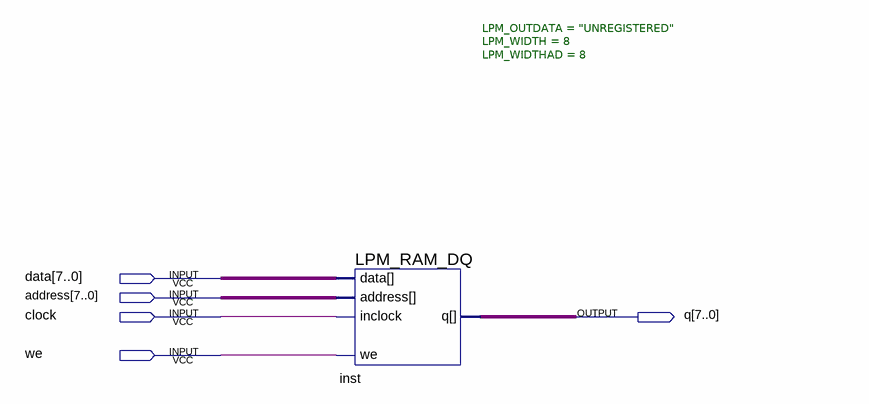
[diagram p0: schematic sheet]
// Quartus schematic RAM.bdf as structural Verilog: 1 symbols, 5 pins
module RAM (
  input  [7:0] data,
  input  [7:0] address,
  input  clock,
  input  we,
  output [7:0] q
);

  LPM_RAM_DQ #(.LPM_OUTDATA("UNREGISTERED"), .LPM_WIDTH(8), .LPM_WIDTHAD(8)) inst (
    .address(address), .data(data), .inclock(clock), .we(we), .q(q));
endmodule
